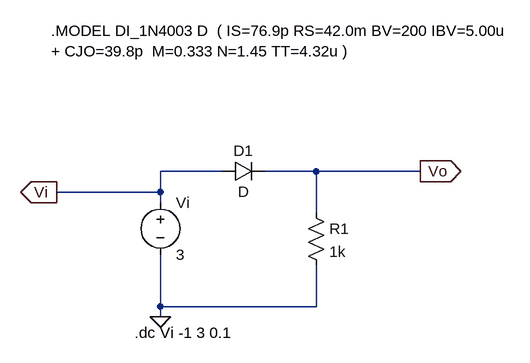
[diagram p0: schematic Simu_A.asc]
Simu_A.asc, the LTspice schematic file:
Version 4.1
SHEET 1 880 680
WIRE 176 48 80 48
WIRE 320 48 240 48
WIRE 480 48 320 48
WIRE 80 80 80 48
WIRE 80 80 -80 80
WIRE 80 96 80 80
WIRE 320 112 320 48
WIRE 80 256 80 176
WIRE 320 256 320 192
WIRE 320 256 80 256
WIRE 80 272 80 256
FLAG 80 272 0
FLAG 480 48 Vo
IOPIN 480 48 Out
FLAG -80 80 Vi
IOPIN -80 80 Out
SYMBOL res 304 96 R0
SYMATTR InstName R1
SYMATTR Value 1k
SYMBOL voltage 80 80 R0
WINDOW 123 0 0 Left 0
WINDOW 39 0 0 Left 0
SYMATTR InstName Vi
SYMATTR Value 3
SYMBOL diode 176 64 R270
WINDOW 0 32 32 VTop 2
WINDOW 3 0 32 VBottom 2
SYMATTR InstName D1
TEXT 40 296 Left 2 !.dc Vi -1 3 0.1
TEXT -88 -168 Left 2 !.MODEL DI_1N4003 D  ( IS=76.9p RS=42.0m BV=200 IBV=5.00u\n+ CJO=39.8p  M=0.333 N=1.45 TT=4.32u )

The netlist it stands for:
* Simu_A.asc
R1 Vo 0 1k
Vi Vi 0 3
D1 Vi Vo D
.model D D
.lib standard.dio
.dc Vi -1 3 0.1
.MODEL DI_1N4003 D  ( IS=76.9p RS=42.0m BV=200 IBV=5.00u
+ CJO=39.8p  M=0.333 N=1.45 TT=4.32u )
.backanno
.end